# EAGLE design SHASwitch2 (EAGLE 6.5.0)
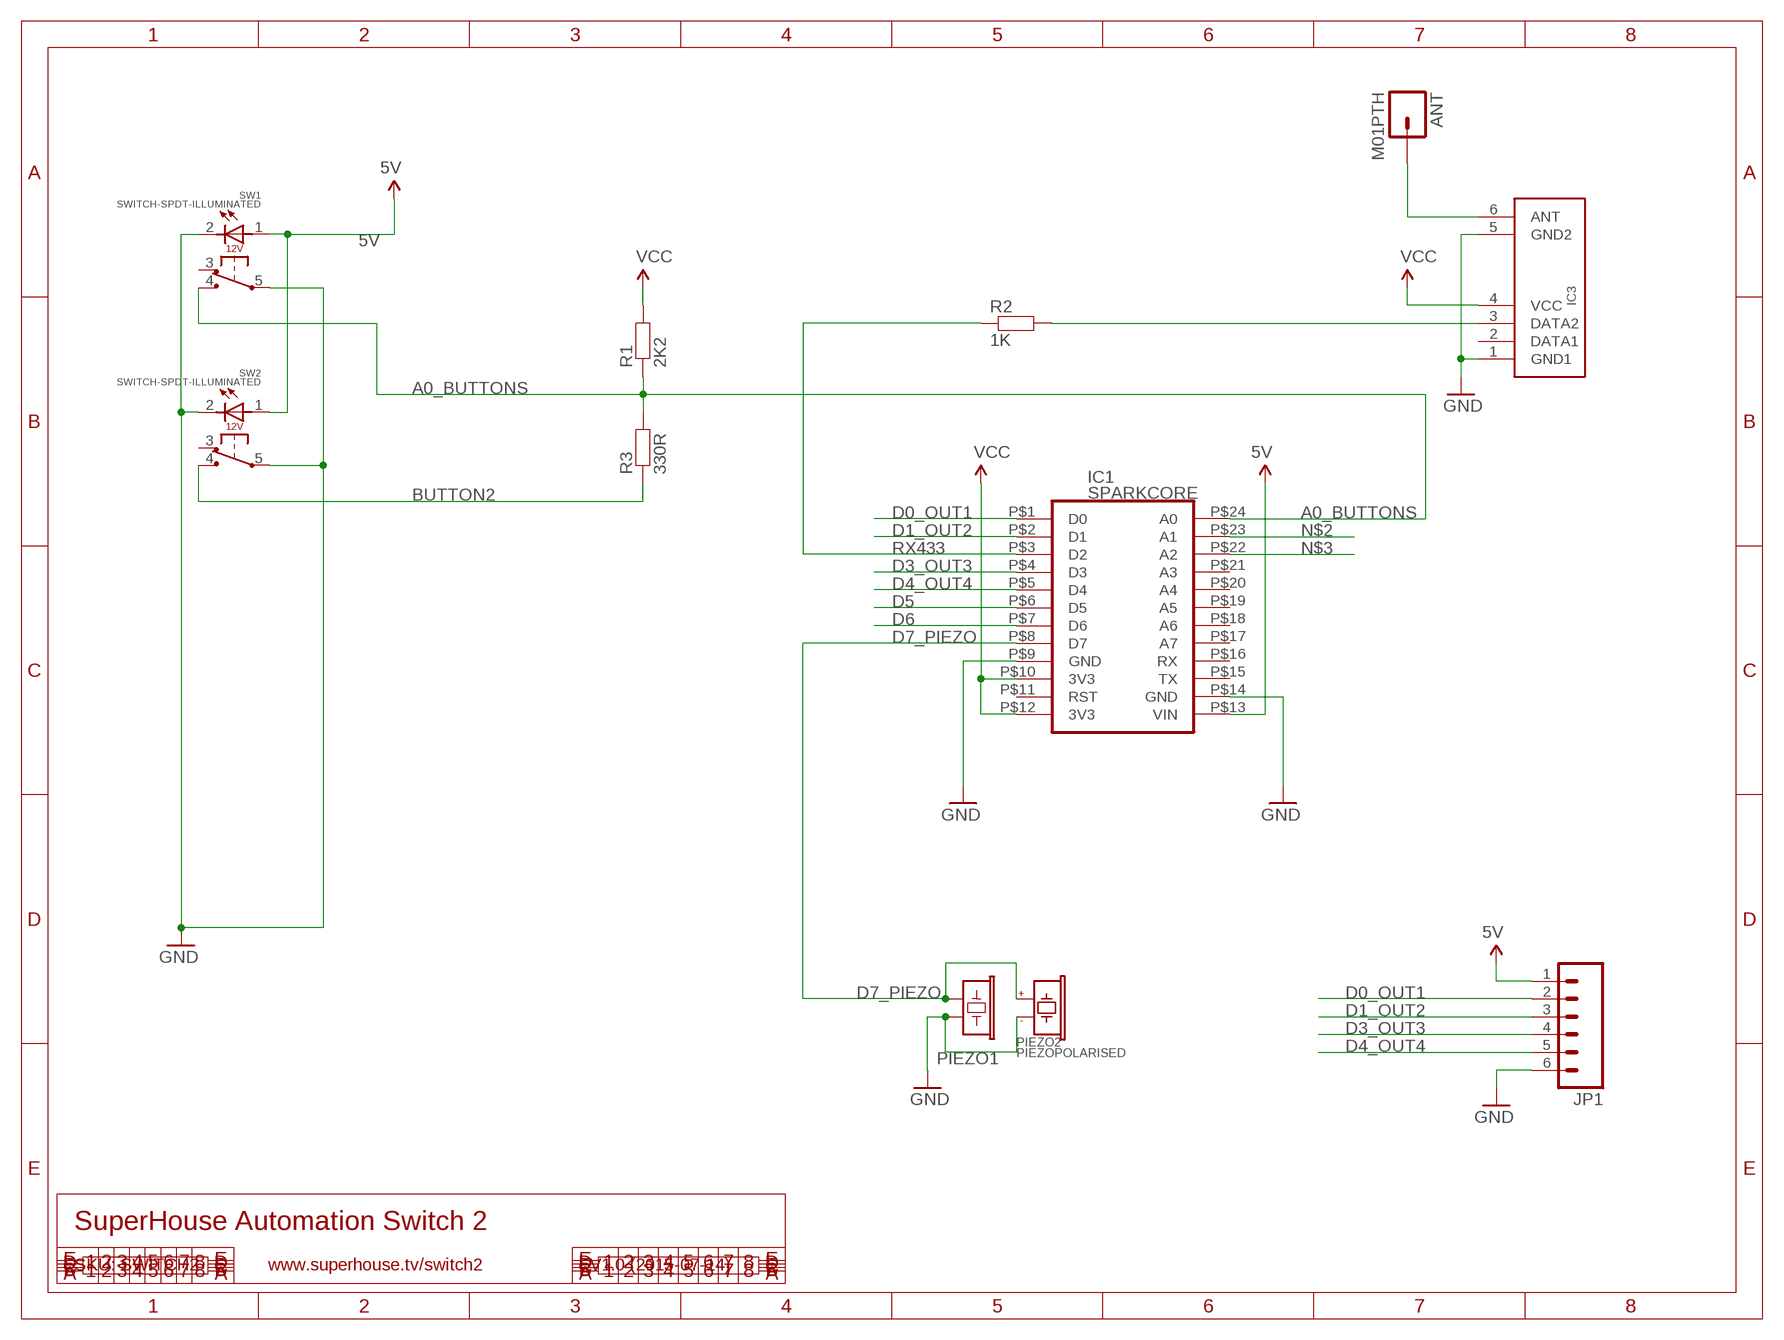
[diagram p0: schematic, sheet 1]

## Parts
ANT  M01PTH  [1X01]
IC1  SPARKCORE  [SPARKCORE]
IC3  RXB1  RXB1SHORTFLAT  [RX-B1-SHORT-FLAT]
JP1  M06SIP  [1X06]
PIEZO1  BUZZERSMD12X12  [BUZZER-12X12-SMT]
PIEZO2  PIEZOPOLARISED  [PIEZO12MMWIDEPOLARISED]
R1  2K2  RESISTOR0603  [0603]
R2  1K  RESISTOR0603  [0603]
R3  330R  RESISTOR0603  [0603]
SW1  SWITCH-SPDT-ILLUMINATED  [SWITCH-SPDT-ILLUMINATED]
SW2  SWITCH-SPDT-ILLUMINATED  [SWITCH-SPDT-ILLUMINATED]

## Nets
5V: IC1.P$13(VIN) JP1.1 SW1.1(+) SW2.1(+)
A0_BUTTONS: IC1.P$24(A0) R1.1 R3.2 SW1.4(NO)
BUTTON2: R3.1 SW2.4(NO)
D0_OUT1: IC1.P$1(D0) JP1.2
D1_OUT2: IC1.P$2(D1) JP1.3
D3_OUT3: IC1.P$4(D3) JP1.4
D4_OUT4: IC1.P$5(D4) JP1.5
D5: IC1.P$6(D5)
D6: IC1.P$7(D6)
D7_PIEZO: IC1.P$8(D7) PIEZO1.1 PIEZO2.1(+)
GND: IC1.P$9(GND) IC1.P$14(GND) IC3.1(GND1) IC3.5(GND2) JP1.6 PIEZO1.2 PIEZO2.2(-) SW1.2(-) SW1.5(COM) SW2.2(-) SW2.5(COM)
N$1: ANT.1 IC3.6(ANT)
N$2: IC1.P$23(A1)
N$3: IC1.P$22(A2)
N$135: IC3.3(DATA2) R2.2
RX433: IC1.P$3(D2) R2.1
VCC [VCC]: IC1.P$10(3V3) IC1.P$12(3V3) IC3.4(VCC) R1.2
Unconnected: IC1.P$11(RST) IC1.P$15(TX) IC1.P$16(RX) IC1.P$17(A7) IC1.P$18(A6) IC1.P$19(A5) IC1.P$20(A4) IC1.P$21(A3) IC3.2(DATA1) SW1.3(NC) SW2.3(NC)

## Notes on the sheet
- SuperHouse Automation Switch 2
- SKU: SWITCH2 | www.superhouse.tv/switch2 | V1.0 (2015-07-14)

## Library data of the parts
ANT = freetronics:M01: Header 1 Standard 1-pin 0.1" header. Use with straight break away headers (SKU : PRT-00116), right angle break away headers (PRT-00553), swiss pins (PRT-00743), machine pins (PRT-00117), and female headers (PRT-00115).
IC1 = freetronics-jon:SPARKCORE
IC3 = freetronics-master-v1:RXB1SHORT
JP1 = freetronics-original:M06: Header 6 Standard 6-pin 0.1" header. Use with straight break away headers (SKU : PRT-00116), right angle break away headers (PRT-00553), swiss pins (PRT-00743), machine pins (PRT-00117), and female headers (PRT-00115). Molex polarized connector foot print use with SKU : PRT-08094 with associated crimp pins and housings. NOTES ON THE VARIANTS LOCK and LOCK_LONGPADS... This footprint was designed to help hold the alignment of a through-hole component (i.e. 6-pin header) while soldering it into place. You may notice that each hole has been shifted either up or down by 0.005 of an inch from it's more standard position (which is a perfectly straight line). This slight alteration caused the pins (the squares in the middle) to touch the edges of the holes. Because they are alternating, it causes a "brace" to hold the component in place. 0.005 has proven to be the perfect amount of "off-center" position when using our standard breakaway headers. Although looks a little odd when you look at the bare footprint, once you have a header in there, the alteration is very hard to notice. Also, if you push a header all the way into place, it is covered up entirely on the bottom side. This idea of altering the position of holes to aid alignment will be further integrated into the Sparkfun Library for other footprints. It can help hold any component with 3 or more connection pins.
PIEZO1 = freetronics-master-v1:BUZZER: Buzzer - Piezo Transducer
PIEZO2 = freetronics-jon:PIEZOPOLARISED
R1-R3 = freetronics:RESISTOR: Resistor Basic schematic elements and footprints for 0603, 1206, and PTH 1/10th watt (small) resistors.
SW1 SW2 = freetronics-jon:SWITCH-SPDT-ILLUMINATED

## Net classes
0 Default: width 0.203 mm
1 VCC: width 0.305 mm

## Board
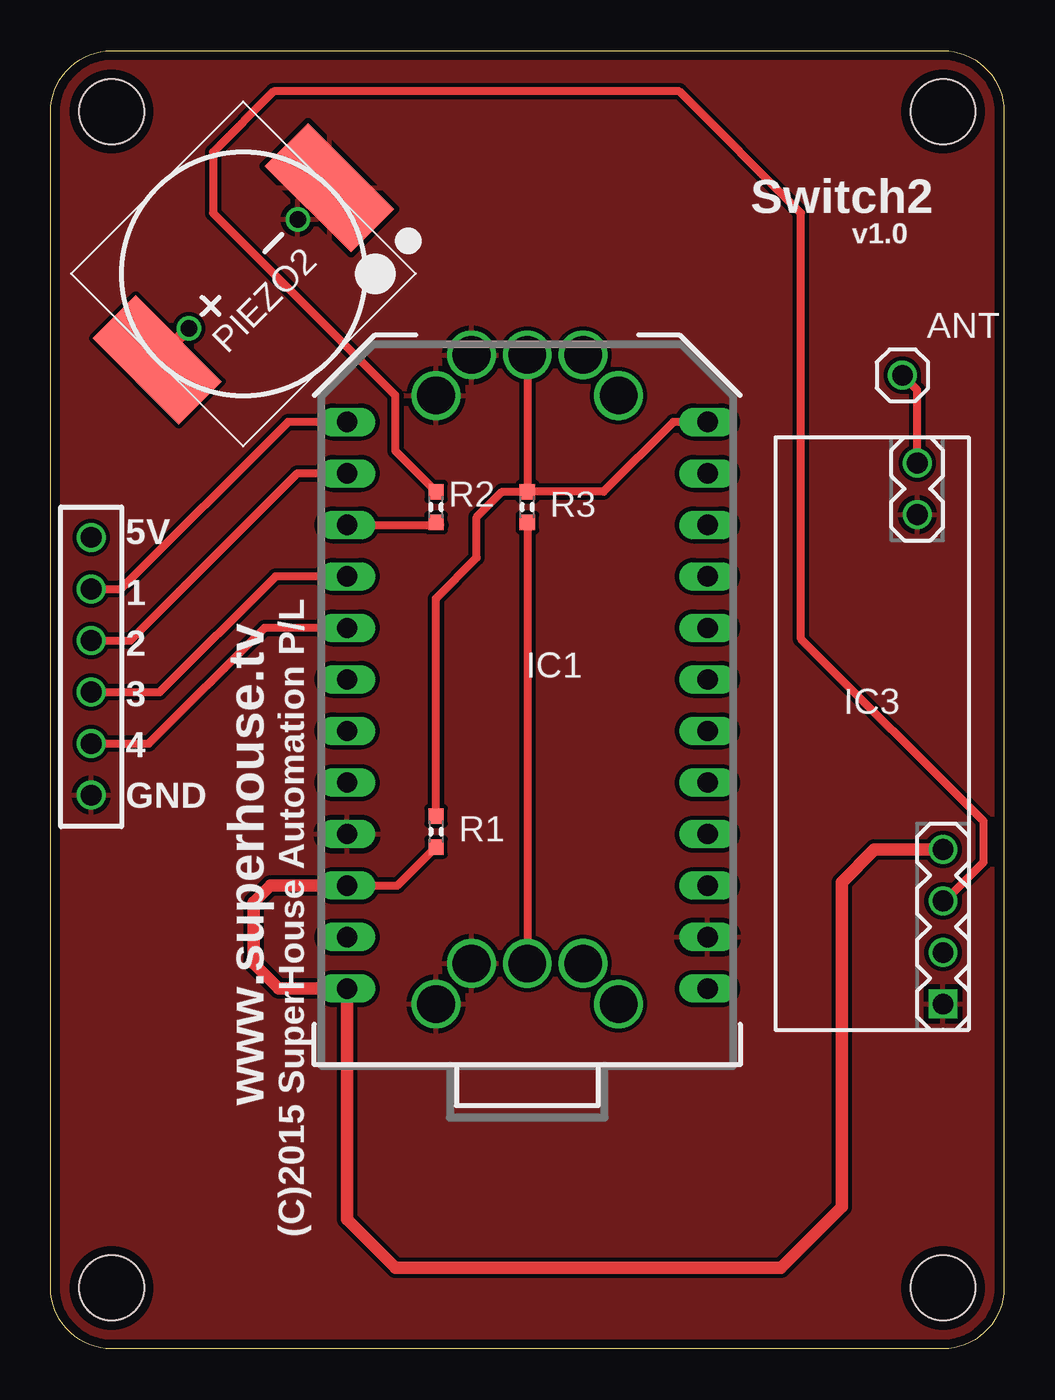
[diagram p1: board, top side]
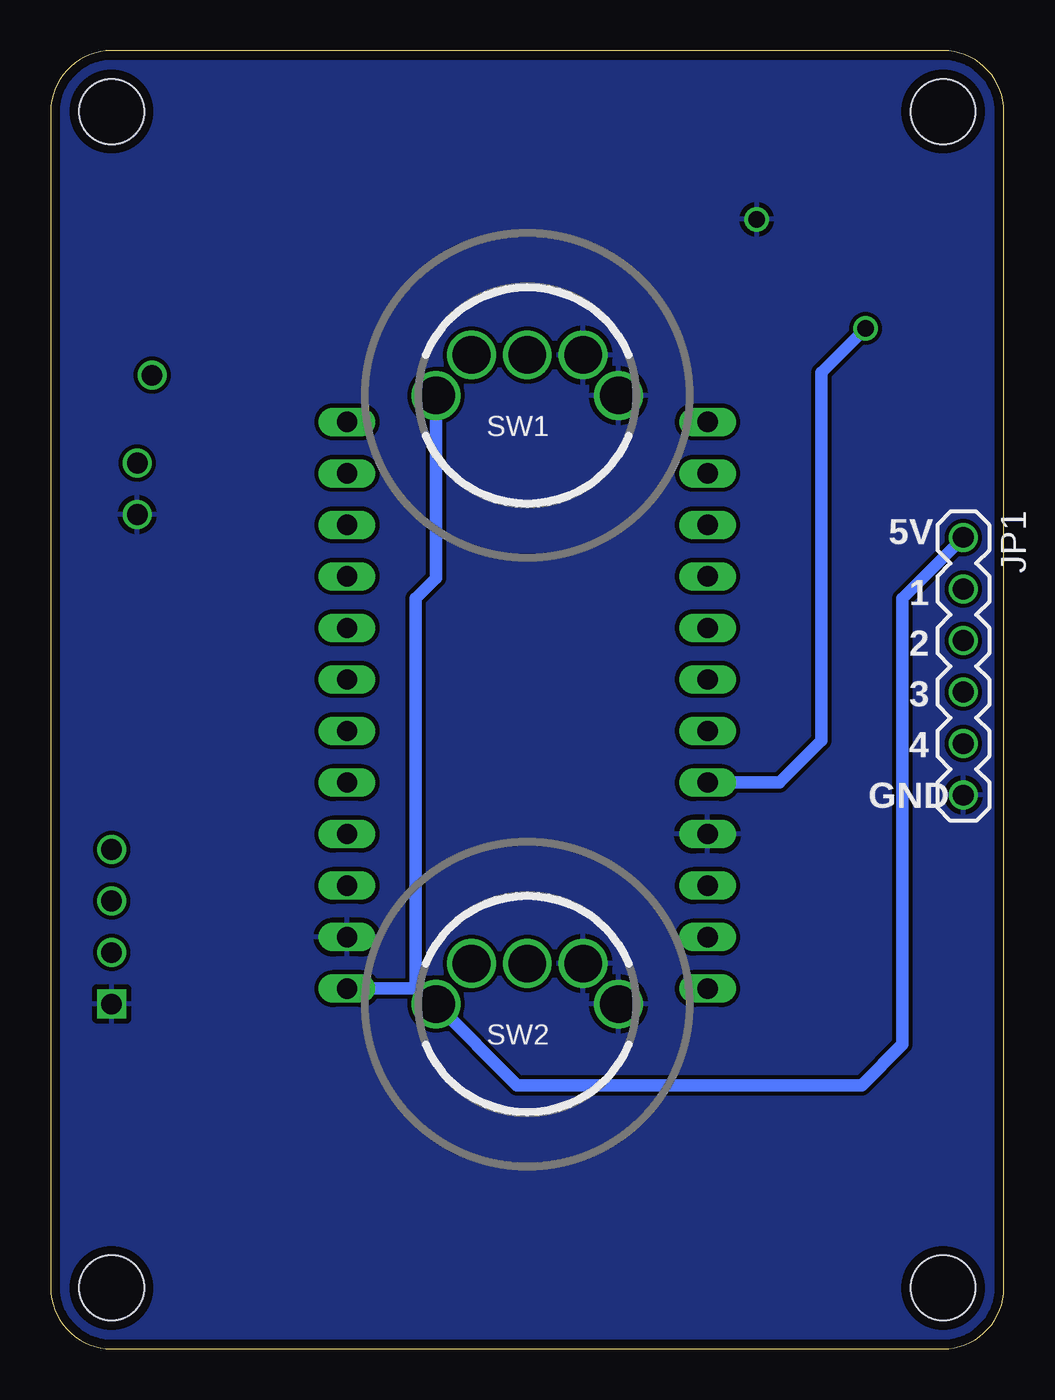
[diagram p2: board, bottom side, seen from below]

Size 47 x 64 mm. Coordinates in mm from the lower left corner, seen from the top.
Outline: 3,64 44,64 arc-90 47,61 47,3 arc-90 44,0 3,0 arc-90 0,3 0,61 arc-90 3,64
Copper layers (1*16): Top 0.035mm / dielectric 1.5mm / Bottom 0.035mm
Design rules "default *": minimum track width 8mil, minimum drill 15mil, track to track 8mil, track to pad 8mil, pad to pad 8mil, via to via 8mil, smd to smd 8mil, copper to edge 18mil, drill to drill 8mil, minimum pad ring 8mil, minimum via ring 6mil, stop-mask expansion 4mil, vias tented up to drill 25mil, thermal gap 10mil
Holes 3.2 mm at 44,3 3,3 3,61 44,61

### Footprints (pad centres in the part's own frame; a part is rotated, then mirrored left to right if it is on the bottom)
1X01 = drill 1.016: 1 0,0
SPARKCORE = drill 1 long: P$1 -8.89,12.7; P$2 -8.89,10.16; P$3 -8.89,7.62; P$4 -8.89,5.08; P$5 -8.89,2.54; P$6 -8.89,0; P$7 -8.89,-2.54; P$8 -8.89,-5.08; P$9 -8.89,-7.62; P$10 -8.89,-10.16; P$11 -8.89,-12.7; P$12 -8.89,-15.24; P$13 8.89,-15.24; P$14 8.89,-12.7; P$15 8.89,-10.16; P$16 8.89,-7.62; P$17 8.89,-5.08; P$18 8.89,-2.54; P$19 8.89,0; P$20 8.89,2.54; P$21 8.89,5.08; P$22 8.89,7.62; P$23 8.89,10.16; P$24 8.89,12.7
RX-B1-SHORT-FLAT = drill 1.016 square: 1 0,0 | drill 1.016: 2 2.54,0; 3 5.08,0; 4 7.62,0; 5 24.13,1.27; 6 26.67,1.27
1X06 = drill 1.016: 1 0,0; 2 2.54,0; 3 5.08,0; 4 7.62,0; 5 10.16,0; 6 12.7,0
BUZZER-12X12-SMT = smd 3 x 6: 1 -6,0; 2 6,0
PIEZO12MMWIDEPOLARISED = drill 0.8: 1 -3.8,0; 2 3.8,0
0603 = smd 0.762 x 0.762: 1 -0.762,0; 2 0.762,0
SWITCH-SPDT-ILLUMINATED = drill 1.85 pad 2.4: 1 -4.5,0; 2 4.5,0; 3 -2.75,2; 4 0,2; 5 2.75,2

### Placement (x,y rotation side)
ANT  42,48 0 top
IC1  23.5,33 0 top
IC3  44,17 90 top
JP1  2,40 270 bottom
PIEZO1  9.5,53 45 top
PIEZO2  9.5,53 45 top
R1  19,25.5 270 top
R2  19,41.5 90 top
R3  23.5,41.5 90 top
SW1  23.5,47 0 bottom
SW2  23.5,17 0 bottom

### Tracks (layer width: path | path; a pad name or v marks a point on that pad's centre or on a via)
5V
  Bottom 0.61: JP1.1 5,37 5,15 7,13 24,13 SW2.1 28.76,17.76 29,17.76 | 29,17.76 29,37 28,38 SW1.1 | IC1.P$13 29,17.76
A0_BUTTONS
  Top 0.406: SW1.4 R3.2 | R3.2 22.26,42.26 21,41 21,39 19,37 R1.1 | IC1.P$24 30.7,45.7 27.26,42.26 R3.2
BUTTON2
  Top 0.406: R3.1 SW2.4
D0_OUT1
  Top 0.406: JP1.2 3.46,37.46 11.7,45.7 IC1.P$1
D1_OUT2
  Top 0.406: JP1.3 3.92,34.92 12.16,43.16 IC1.P$2
D3_OUT3
  Top 0.406: JP1.4 5.38,32.38 11.08,38.08 IC1.P$4
D4_OUT4
  Top 0.406: JP1.5 4.84,29.84 10.54,35.54 IC1.P$5
D7_PIEZO
  Top 0.61: PIEZO2.1 PIEZO1.1
  Bottom 0.61: IC1.P$8 11.08,27.92 9,30 9,48.13 PIEZO2.1
GND
  pour Top: 3,0 44,0 arc90 47,3 47,61 arc90 44,64 3,64 arc90 0,61 0,3 arc90
  pour Bottom: 3,0 44,0 arc90 47,3 47,61 arc90 44,64 3,64 arc90 0,61 0,3 arc90
N$1
  Top 0.406: IC3.6 42.73,47.27 ANT.1
N$135
  Top 0.406: IC3.3 44.08,22.08 46,24 46,26 37,35 37,56 31,62 11,62 8,59 8,56 17,47 17,44.26 R2.2
RX433
  Top 0.406: IC1.P$3 19.22,40.62 R2.1
VCC
  Top 0.406: IC1.P$10 17.1,22.84 R1.2
  Top 0.61: IC3.4 40.62,24.62 39,23 39,7 36,4 17,4 14.61,6.39 IC1.P$12 11.24,17.76 10,19 10,22 10.84,22.84 IC1.P$10

### Text on the board
tPlace: Switch2 | v1.0 | 5V | 1 | 2 | 3 | 4 | GND | www.superhouse.tv | (C)2015 SuperHouse Automation P/L
bPlace: 5V | 1 | 2 | 3 | 4 | GND